# Altium schematic sheet 全桥驱动.SchDoc
size A3
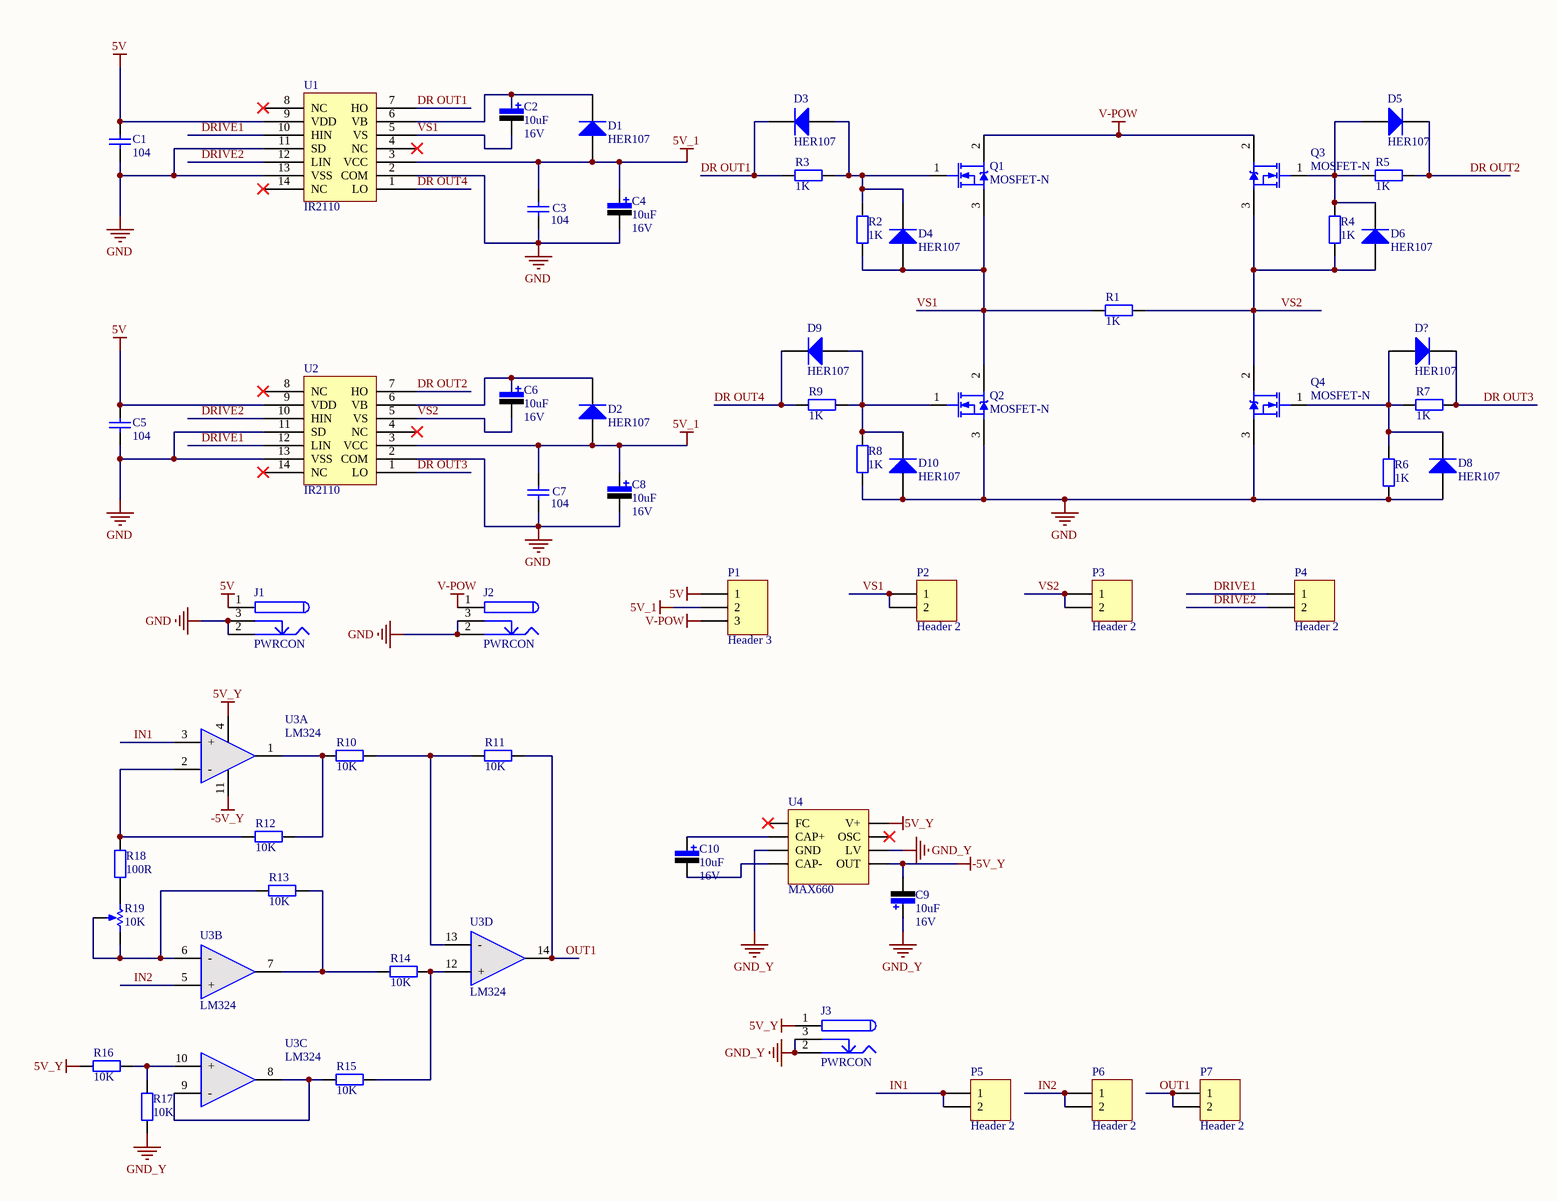
[diagram p0: 全桥驱动.SchDoc]

## Parts
C1  value 104  [C-RAD]  (hidden comment: Cap)
C2  value 10uF  Vol: 16V  [C-DIP-2.54]  (hidden comment: Cap Pol)
C3  value 104  [C-RAD]  (hidden comment: Cap)
C4  value 10uF  Vol: 16V  [C-DIP-2.54]  (hidden comment: Cap Pol)
C5  value 104  [C-RAD]  (hidden comment: Cap)
C6  value 10uF  Vol: 16V  [C-DIP-2.54]  (hidden comment: Cap Pol)
C7  value 104  [C-RAD]  (hidden comment: Cap)
C8  value 10uF  Vol: 16V  [C-DIP-2.54]  (hidden comment: Cap Pol)
C9  value 10uF  Vol: 16V  [C-DIP-2.54]  (hidden comment: Cap Pol)
C10  value 10uF  Vol: 16V  [C-DIP-2.54]  (hidden comment: Cap Pol)
D1  Type: HER107  [DIODE-AXL]  (hidden comment: Diode)
D2  Type: HER107  [DIODE-AXL]  (hidden comment: Diode)
D3  Type: HER107  [DIODE-AXL]  (hidden comment: Diode)
D4  Type: HER107  [DIODE-AXL]  (hidden comment: Diode)
D5  Type: HER107  [DIODE-AXL]  (hidden comment: Diode)
D6  Type: HER107  [DIODE-AXL]  (hidden comment: Diode)
D8  Type: HER107  [DIODE-AXL]  (hidden comment: Diode)
D9  Type: HER107  [DIODE-AXL]  (hidden comment: Diode)
D10  Type: HER107  [DIODE-AXL]  (hidden comment: Diode)
D?  Type: HER107  [DIODE-AXL]  (hidden comment: Diode)
J1  PWRCON  [DC-005]
J2  PWRCON  [DC-005]
J3  PWRCON  [DC-005]
P1  Header 3  [HDR1X3]
P2  Header 2  [HDR1X2]
P3  Header 2  [HDR1X2]
P4  Header 2  [HDR1X2]
P5  Header 2  [HDR1X2]
P6  Header 2  [HDR1X2]
P7  Header 2  [HDR1X2]
Q1  MOSFET-N  [TO-220AB - USE]
Q2  MOSFET-N  [TO-220AB - USE]
Q3  MOSFET-N  [TO-220AB - USE]
Q4  MOSFET-N  [TO-220AB - USE]
R1  1K  [AXIAL-0.3]
R2  1K  [AXIAL-0.3]
R3  1K  [AXIAL-0.3]
R4  1K  [AXIAL-0.3]
R5  1K  [AXIAL-0.3]
R6  1K  [AXIAL-0.3]
R7  1K  [AXIAL-0.3]
R8  1K  [AXIAL-0.3]
R9  1K  [AXIAL-0.3]
R10  10K  [AXIAL-0.3]
R11  10K  [AXIAL-0.3]
R12  10K  [AXIAL-0.3]
R13  10K  [AXIAL-0.3]
R14  10K  [AXIAL-0.3]
R15  10K  [AXIAL-0.3]
R16  10K  [AXIAL-0.3]
R17  10K  [AXIAL-0.3]
R18  100R  [AXIAL-0.3]
R19  value 10K  [VR_A1]  (hidden comment: RPot)
U1  IR2110  [DIP-14]
U2  IR2110  [DIP-14]
U3  LM324  [DIP-14]  (parts A,B,C,D of 4)
U4  MAX660  [DIP8]

## Nets
5V: C1.2 C5.2 J1.1 P1.1 U1.9(VDD) U2.9(VDD)
5V_1: C3.2 C4.1 C7.2 C8.1 D1.1(A) D2.1(A) P1.2 U1.3(VCC) U2.3(VCC)
5V_Y: J3.1 R16.2 U3.4(V+) U4.8(V+)
-5V_Y: C9.2 U3.11(V-) U4.5(OUT)
GND: C1.1 C3.1 C4.2 C5.1 C7.1 C8.2 D8.1(A) D10.1(A) J1.2 J1.3 J2.2 J2.3 Q2.3(S) Q4.3(S) R6.2 R8.1 U1.2(COM) U1.11(SD) U1.13(VSS) U2.2(COM) U2.11(SD) U2.13(VSS)
GND_Y: C9.1 J3.2 J3.3 R17.2 U4.3(GND) U4.6(LV)
V-POW: J2.1 P1.3 Q1.2(D) Q3.2(D)
DR OUT1: D3.2(K) R3.1 U1.7(HO)
DR OUT2: D5.2(K) R5.1 U2.7(HO)
DR OUT3: D?.2(K) R7.2 U2.1(LO)
DR OUT4: D9.2(K) R9.2 U1.1(LO)
DRIVE1: P4.1 U1.10(HIN) U2.12(LIN)
DRIVE2: P4.2 U1.12(LIN) U2.10(HIN)
IN1: P5.1 P5.2 U3.3(+)
IN2: P6.1 P6.2 U3.5(+)
OUT1: P7.1 P7.2 R11.1 U3.14(OUT)
VS1: C2.2 D4.1(A) P2.1 P2.2 Q1.3(S) Q2.2(D) R1.1 R2.2 U1.5(VS)
VS2: C6.2 D6.1(A) P3.1 P3.2 Q3.3(S) Q4.2(D) R1.2 R4.1 U2.5(VS)
NetC2_1: C2.1 D1.2(K) U1.6(VB)
NetC6_1: C6.1 D2.2(K) U2.6(VB)
NetC10_1: C10.1 U4.2(CAP+)
NetC10_2: C10.2 U4.4(CAP-)
NetD3_1: D3.1(A) D4.2(K) Q1.1(G) R2.1 R3.2
NetD5_1: D5.1(A) D6.2(K) Q3.1(G) R4.2 R5.2
NetD8_2: D8.2(K) D?.1(A) Q4.1(G) R6.1 R7.1
NetD9_1: D9.1(A) D10.2(K) Q2.1(G) R8.2 R9.1
NetR10_1: R10.1 R11.2 U3.13(-)
NetR10_2: R10.2 R12.1 U3.1(OUT)
NetR12_2: R12.2 R18.1 U3.2(-)
NetR13_1: R13.1 R14.2 U3.7(OUT)
NetR13_2: R13.2 R19.2(TAP) R19.3(BOT) U3.6(-)
NetR14_1: R14.1 R15.1 U3.12(+)
NetR15_2: R15.2 U3.8(OUT) U3.9(-)
NetR16_1: R16.1 R17.1 U3.10(+)
NetR18_2: R18.2 R19.1(TOP)

Not connected (* = marked no-connect by the designer): U1 4(NC)* 8(NC)* 14(NC)*; U2 4(NC)* 8(NC)* 14(NC)*; U4 1(FC)* 7(OSC)*

## Notes on the sheet
- Title
- Size:
- Date:
- A3
- Number:
- Time:
- Revision:
- Sheet
- of
- File:

## Library data of the parts
C1 C3 C5 C7 = Cap: 无极性电容; Published: 8-Jun-2000; LatestRevisionDate: 17-Jul-2002; LatestRevisionNote: Re-released for DXP Platform.; PackageReference: RAD-0.3; Publisher: Altium Limited
C2 C4 C6 C8-C10 = Cap Pol: 极性电解电容; Published: 8-Jun-2000; LatestRevisionDate: 17-Jul-2002; LatestRevisionNote: Re-released for DXP Platform.; PackageReference: RB7.6-15; Publisher: Altium Limited
D1-D6 D8-D10 D? = Diode_1: 二极管; Published: 8-Jun-2000; LatestRevisionDate: 17-Jul-2002; LatestRevisionNote: Re-released for DXP Platform.; PackageDocument: Sep-1996; PackageReference: SMC; Publisher: Altium Limited; Code_JEDEC: DO-214-AB
J1-J3 = PWRCON: 直流电源端子; Published: 17-Dec-2003; DatasheetDocument: 09-May-2002; Publisher: Altium Limited; ComponentLink1Description: Manufacturer Link; ComponentLink1URL: http://domino.kycon.com/internet/Products.html
P1 = Header 3: Header, 3-Pin; LatestRevisionDate: 17-Jul-2002; LatestRevisionNote: Re-released for DXP Platform.; Publisher: Altium Limited
P2-P7 = Header 2: Header, 2-Pin; LatestRevisionDate: 17-Jul-2002; LatestRevisionNote: Re-released for DXP Platform.; Publisher: Altium Limited
Q1-Q4 = MOSFET-N_USE: N-Channel MOSFET; PackageDocument: 1995/1996; Published: 8-Jun-2000; LatestRevisionDate: 17-Jul-2002; LatestRevisionNote: Re-released for DXP Platform.; PackageReference: E3; Publisher: Altium Limited
R1-R18 = Res_1
  R1-R9: value: 1K
  R10-R17: value: 10K
  R18: value: 100R
R19 = RPot: 精密可调电阻; Sim Note: Enter the Resistance value and the set point into parameter fields.; Set Position: 0.5; Published: 8-Jun-2000; LatestRevisionDate: 17-Jul-2002; LatestRevisionNote: Re-released for DXP Platform.; PackageReference: VR5; Publisher: Altium Limited
U3 = LM324: 4运放SOP8芯片